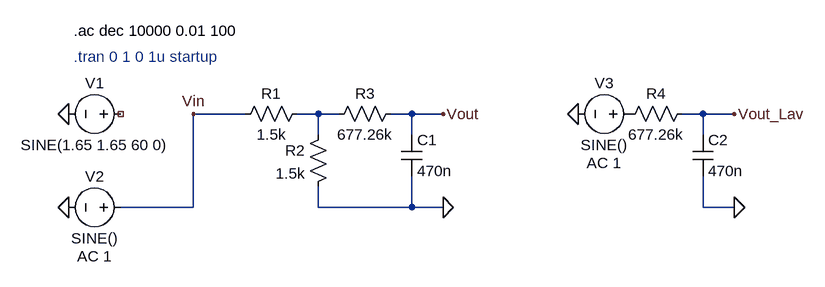
[diagram p0: schematic LDR-LP-SunSensor.asc]
LDR-LP-SunSensor.asc, the LTspice schematic file:
Version 4
SHEET 1 1184 680
WIRE 304 128 224 128
WIRE 416 128 384 128
WIRE 448 128 416 128
WIRE 560 128 528 128
WIRE 608 128 560 128
WIRE 1008 128 976 128
WIRE 1056 128 1008 128
WIRE 416 160 416 128
WIRE 560 160 560 128
WIRE 1008 160 1008 128
WIRE 224 272 224 128
WIRE 224 272 112 272
WIRE 416 272 416 240
WIRE 560 272 560 224
WIRE 560 272 416 272
WIRE 608 272 560 272
WIRE 1008 272 1008 224
WIRE 1056 272 1008 272
FLAG 608 128 Vout
FLAG 224 128 Vin
FLAG 32 128 0
FLAG 32 272 0
FLAG 608 272 0
FLAG 1056 128 Vout_Lav
FLAG 1056 272 0
FLAG 816 128 0
SYMBOL voltage 128 128 R90
WINDOW 0 -32 56 VBottom 2
WINDOW 3 32 56 VTop 2
WINDOW 123 0 0 Left 0
WINDOW 39 0 0 Left 0
SYMATTR InstName V1
SYMATTR Value SINE(1.65 1.65 60 0)
SYMBOL voltage 128 272 R90
WINDOW 0 -32 56 VBottom 2
WINDOW 3 32 56 VTop 2
WINDOW 123 60 56 VTop 2
WINDOW 39 0 0 Left 0
SYMATTR InstName V2
SYMATTR Value SINE()
SYMATTR Value2 AC 1
SYMBOL res 288 144 R270
WINDOW 0 32 56 VTop 2
WINDOW 3 0 56 VBottom 2
SYMATTR InstName R1
SYMATTR Value 1.5k
SYMBOL res 432 144 M0
SYMATTR InstName R2
SYMATTR Value 1.5k
SYMBOL res 432 144 R270
WINDOW 0 32 56 VTop 2
WINDOW 3 0 56 VBottom 2
SYMATTR InstName R3
SYMATTR Value 677.26k
SYMBOL cap 544 160 R0
SYMATTR InstName C1
SYMATTR Value 470n
SYMBOL res 880 144 R270
WINDOW 0 32 56 VTop 2
WINDOW 3 0 56 VBottom 2
SYMATTR InstName R4
SYMATTR Value 677.26k
SYMBOL cap 992 160 R0
SYMATTR InstName C2
SYMATTR Value 470n
SYMBOL voltage 912 128 R90
WINDOW 0 -32 56 VBottom 2
WINDOW 3 32 56 VTop 2
WINDOW 123 60 56 VTop 2
WINDOW 39 0 0 Left 0
SYMATTR InstName V3
SYMATTR Value SINE()
SYMATTR Value2 AC 1
TEXT 40 0 Left 2 !.ac dec 10000 0.01 100
TEXT 40 40 Left 2 ;.tran 0 1 0 1u startup

The netlist it stands for:
* LDR-LP-SunSensor.asc
V1 NC_01 0 SINE(1.65 1.65 60 0)
V2 Vin 0 SINE() AC 1
R1 Vin N001 1.5k
R2 N001 0 1.5k
R3 N001 Vout 677.26k
C1 Vout 0 470n
R4 P001 Vout_Lav 677.26k
C2 Vout_Lav 0 470n
V3 P001 0 SINE() AC 1
.ac dec 10000 0.01 100
* .tran 0 1 0 1u startup
.backanno
.end